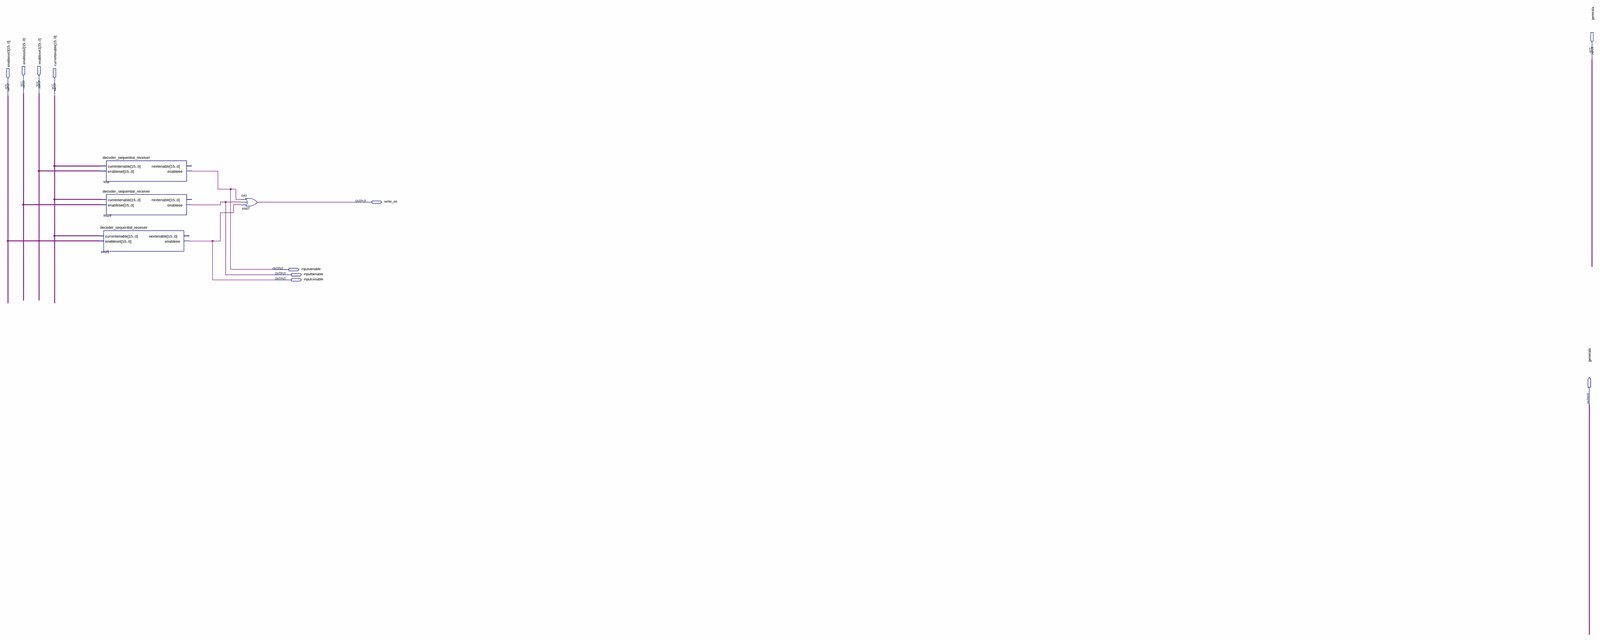
[diagram p0: schematic sheet, whole]
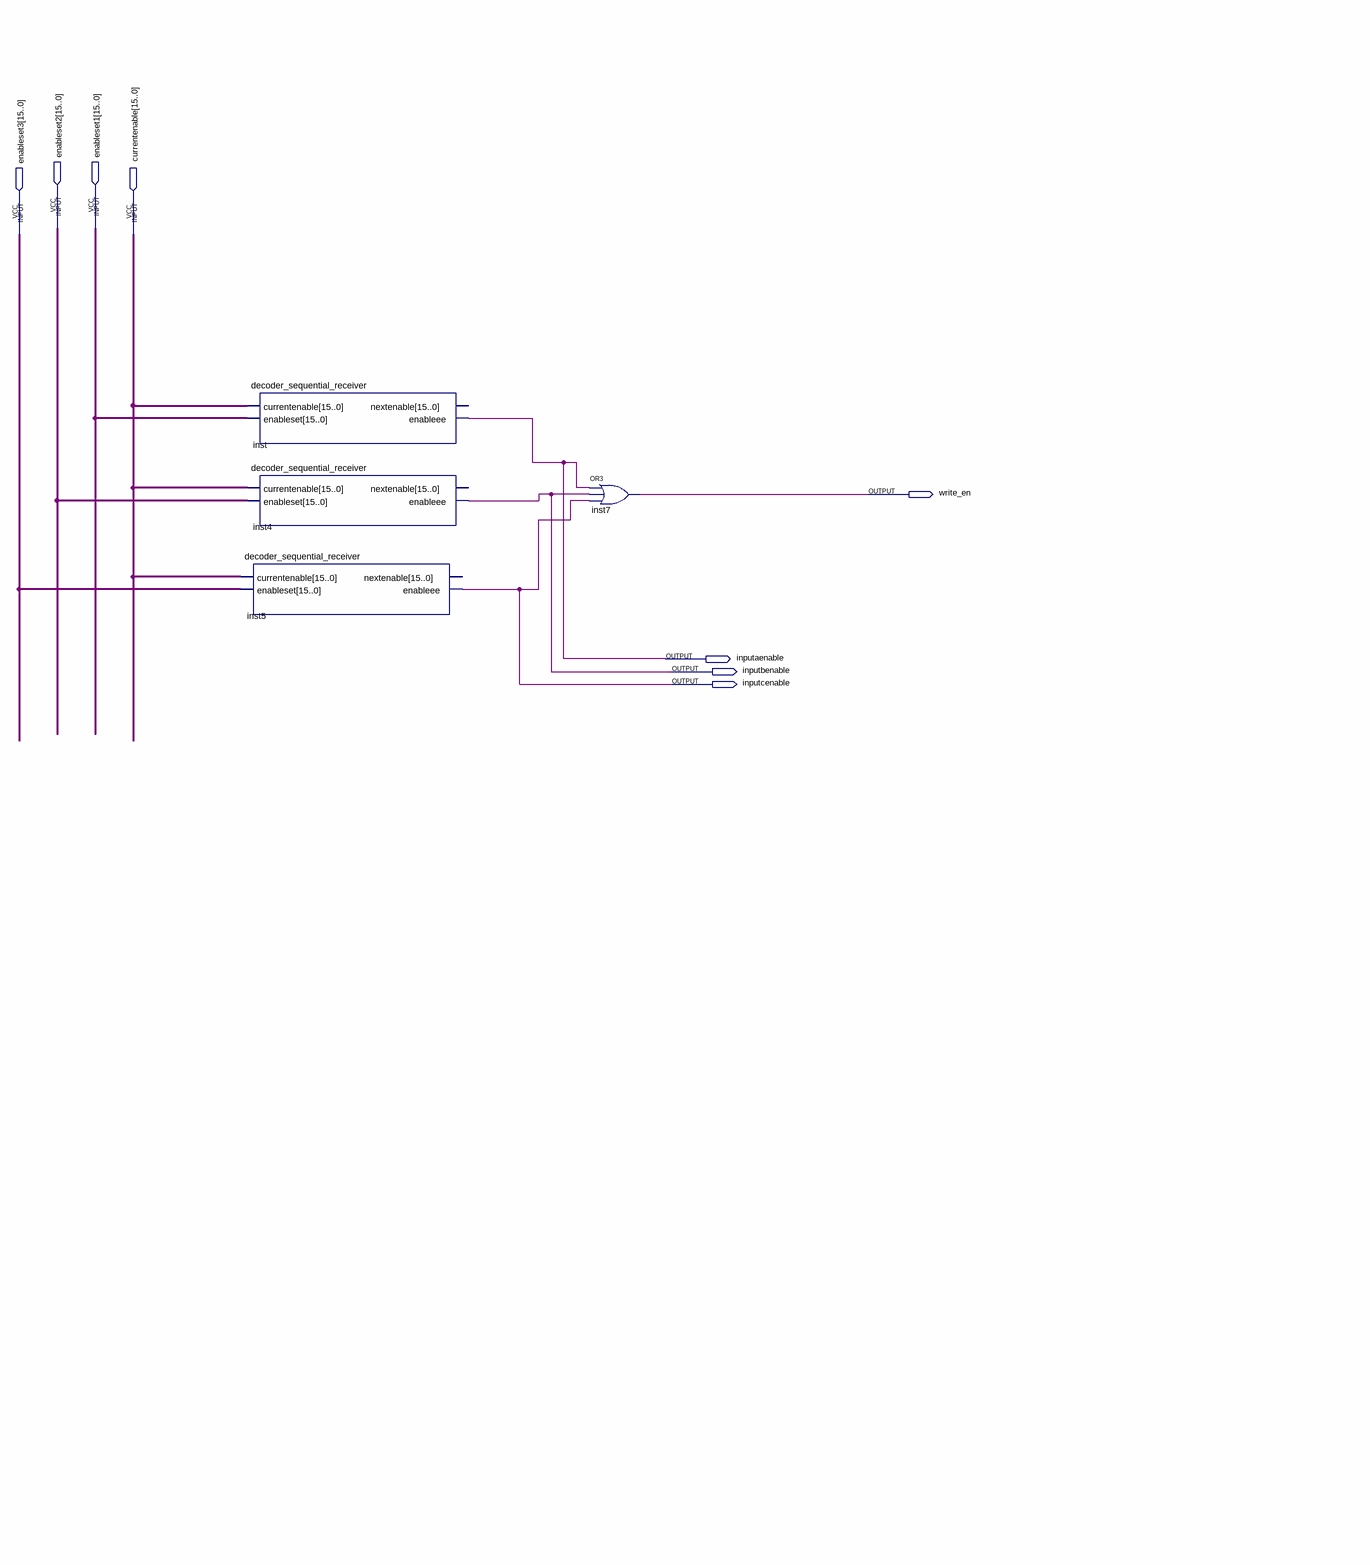
[diagram p1: schematic sheet, left part]
// Quartus schematic b_invreg_write_selector.bdf as structural Verilog: 4 symbols, 10 pins
module b_invreg_write_selector (
  input  generala,
  input  [15:0] enableset2,
  input  [15:0] enableset1,
  input  [15:0] enableset3,
  input  [15:0] currentenable,
  output write_en,
  output inputaenable,
  output inputbenable,
  output inputcenable,
  output generalc
);

  decoder_sequential_receiver inst5 (
    .currentenable(currentenable), .enableset(enableset3), .enableee(inputcenable));  // open: nextenable
  decoder_sequential_receiver inst (
    .currentenable(currentenable), .enableset(enableset1), .enableee(inputaenable));  // open: nextenable
  decoder_sequential_receiver inst4 (
    .currentenable(currentenable), .enableset(enableset2), .enableee(inputbenable));  // open: nextenable
  or inst7 (write_en, inputaenable, inputbenable, inputcenable);
endmodule
